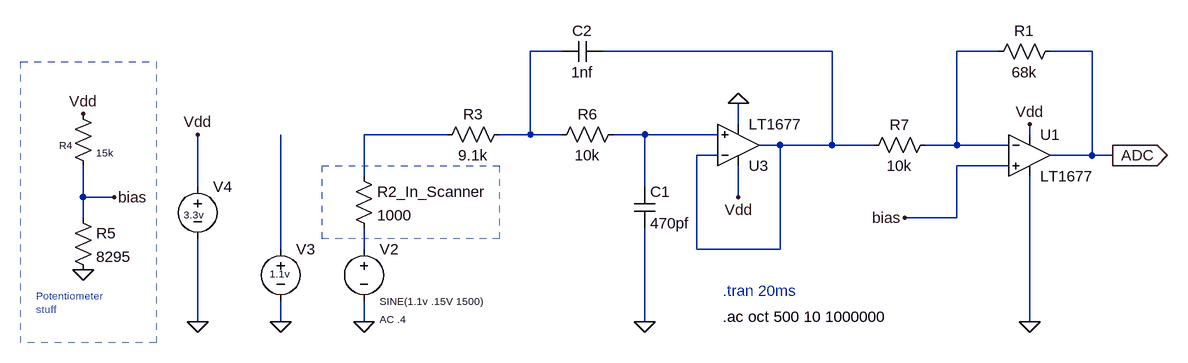
[diagram p0: schematic pico_dm_final.asc]
pico_dm_final.asc, the LTspice schematic file:
Version 4.1
SHEET 1 880 680
WIRE -288 0 -336 0
WIRE 128 0 -224 0
WIRE 384 0 320 0
WIRE 528 0 464 0
WIRE -16 112 -16 80
WIRE -464 128 -592 128
WIRE -336 128 -336 0
WIRE -336 128 -384 128
WIRE -288 128 -336 128
WIRE -160 128 -208 128
WIRE -48 128 -160 128
WIRE 432 128 432 112
WIRE 48 144 16 144
WIRE 128 144 128 0
WIRE 128 144 48 144
WIRE 192 144 128 144
WIRE 320 144 320 0
WIRE 320 144 272 144
WIRE 400 144 320 144
WIRE -48 160 -80 160
WIRE 528 160 528 0
WIRE 528 160 464 160
WIRE 560 160 528 160
WIRE 400 176 320 176
WIRE -592 192 -592 128
WIRE -848 208 -848 128
WIRE -160 208 -160 128
WIRE -1024 224 -1024 176
WIRE -976 224 -1024 224
WIRE -16 224 -16 176
WIRE -1024 256 -1024 224
WIRE 320 256 320 176
WIRE 320 256 240 256
WIRE -720 304 -720 128
WIRE -592 304 -592 272
WIRE -80 304 -80 160
WIRE 48 304 48 144
WIRE 48 304 -80 304
WIRE -848 416 -848 288
WIRE -720 416 -720 384
WIRE -592 416 -592 384
WIRE -160 416 -160 272
WIRE 432 416 432 192
FLAG 432 416 0
FLAG 432 112 Vdd
FLAG -592 416 0
FLAG -16 80 0
FLAG -16 224 Vdd
FLAG 560 160 ADC
IOPIN 560 160 Out
FLAG -720 416 0
FLAG -160 416 0
FLAG -848 416 0
FLAG -848 128 Vdd
FLAG -1024 96 Vdd
FLAG -1024 336 0
FLAG -976 224 bias
FLAG 240 256 bias
SYMBOL OpAmps\\LT1677 432 96 R0
SYMATTR InstName U1
SYMBOL res 480 -16 R90
WINDOW 0 0 56 VBottom 2
WINDOW 3 32 56 VTop 2
SYMATTR InstName R1
SYMATTR Value 68k
SYMBOL voltage -592 288 R0
WINDOW 123 24 124 Left 1
WINDOW 39 0 0 Left 0
WINDOW 3 24 96 Left 1
SYMATTR Value2 AC .4
SYMATTR Value SINE(1.1v .15V 1500)
SYMATTR InstName V2
SYMBOL OpAmps\\LT1677 -16 208 M180
SYMATTR InstName U3
SYMBOL res -192 112 R90
WINDOW 0 0 56 VBottom 2
WINDOW 3 32 56 VTop 2
SYMATTR InstName R6
SYMATTR Value 10k
SYMBOL voltage -720 288 R0
WINDOW 123 0 0 Left 0
WINDOW 39 0 0 Left 0
WINDOW 3 -17 54 Left 1
SYMATTR Value 1.1v
SYMATTR InstName V3
SYMBOL res -608 176 R0
SYMATTR InstName R2_In_Scanner
SYMATTR Value 1000
SYMBOL res 288 128 R90
WINDOW 0 0 56 VBottom 2
WINDOW 3 32 56 VTop 2
SYMATTR InstName R7
SYMATTR Value 10k
SYMBOL res -368 112 R90
WINDOW 0 0 56 VBottom 2
WINDOW 3 32 56 VTop 2
SYMATTR InstName R3
SYMATTR Value 9.1k
SYMBOL cap -176 208 R0
SYMATTR InstName C1
SYMATTR Value 470pf
SYMBOL cap -224 -16 R90
WINDOW 0 0 32 VBottom 2
WINDOW 3 32 32 VTop 2
SYMATTR InstName C2
SYMATTR Value 1nf
SYMBOL voltage -848 192 R0
WINDOW 3 -21 59 Left 1
WINDOW 123 0 0 Left 0
WINDOW 39 0 0 Left 0
SYMATTR Value 3.3v
SYMATTR InstName V4
SYMBOL res -1040 80 R0
WINDOW 0 -21 64 Left 1
WINDOW 3 36 76 Left 1
SYMATTR InstName R4
SYMATTR Value 15k
SYMBOL res -1040 240 R0
SYMATTR InstName R5
SYMATTR Value 8295
TEXT -40 368 Left 2 ;.tran 20ms
TEXT -40 408 Left 2 !.ac oct 500 10 1000000
TEXT -1096 376 Left 1 ;Potentiometer\nstuff
RECTANGLE Normal -384 288 -656 176 2
RECTANGLE Normal -912 448 -1120 16 2

The netlist it stands for:
* pico_dm_final.asc
X§U1 bias N003 Vdd 0 ADC LT1677  ; pins In+ In- V+ V- OUT
R1 ADC N003 68k
V2 N007 0 SINE(1.1v .15V 1500) AC .4
X§U3 N005 N002 Vdd 0 N002 LT1677  ; pins In+ In- V+ V- OUT
R6 N005 N001 10k
V3 N006 0 1.1v
R2_In_Scanner N004 N007 1000
R7 N003 N002 10k
R3 N001 N004 9.1k
C1 N005 0 470pf
C2 N002 N001 1nf
V4 Vdd 0 3.3v
R4 Vdd bias 15k
R5 bias 0 8295
* .tran 20ms
.ac oct 500 10 1000000
* Potentiometer
* stuff
.lib LTC.lib
.backanno
.end